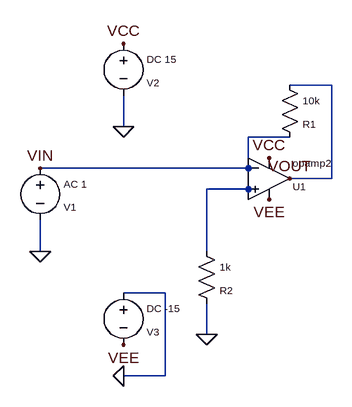
[diagram p0: schematic noninverting_amplifier_unbeautified.asc]
noninverting_amplifier_unbeautified.asc, the LTspice schematic file:
Version 4
SHEET 1 1096 1096
WIRE 100 420 420 420
WIRE 100 500 100 548
WIRE 484 436 548 436
WIRE 548 436 548 292
WIRE 548 292 484 292
WIRE 484 372 420 372
WIRE 420 372 420 452
WIRE 420 452 356 452
WIRE 356 452 356 548
WIRE 356 628 356 676
WIRE 228 308 228 356
WIRE 228 612 292 612
WIRE 292 612 292 740
WIRE 292 740 228 740
FLAG 452 404 VCC
FLAG 228 228 VCC
FLAG 452 468 VEE
FLAG 228 692 VEE
FLAG 100 420 VIN
FLAG 484 436 VOUT
SYMBOL voltage 100 404 R0
SYMATTR InstName V1
WINDOW 0 36 76 Left 1
SYMATTR Value AC 1
WINDOW 3 36 40 Left 1
FLAG 100 548 0
SYMBOL opamp2 452 372 R0
SYMATTR InstName U1
WINDOW 0 36 76 Left 1
WINDOW 3 36 40 Left 1
SYMBOL res 468 276 R0
SYMATTR InstName R1
WINDOW 0 36 76 Left 1
SYMATTR Value 10k
WINDOW 3 36 40 Left 1
SYMBOL res 340 532 R0
SYMATTR InstName R2
WINDOW 0 36 76 Left 1
SYMATTR Value 1k
WINDOW 3 36 40 Left 1
FLAG 356 676 0
SYMBOL voltage 228 212 R0
SYMATTR InstName V2
WINDOW 0 36 76 Left 1
SYMATTR Value DC 15
WINDOW 3 36 40 Left 1
FLAG 228 356 0
SYMBOL voltage 228 596 R0
SYMATTR InstName V3
WINDOW 0 36 76 Left 1
SYMATTR Value DC -15
WINDOW 3 36 40 Left 1
FLAG 228 740 0

The netlist it stands for:
* noninverting_amplifier_unbeautified.asc
V1 VIN 0 AC 1
XU1 VIN VIN VCC VEE VOUT opamp2  ; pins In+ In- V+ V- OUT
R1 VOUT VIN 10k
R2 VIN 0 1k
V2 VCC 0 DC 15
V3 0 VEE DC -15
.backanno
.end